# EAGLE design charginator_v1 (EAGLE 9.3.0)

## Sheet 1 of 4
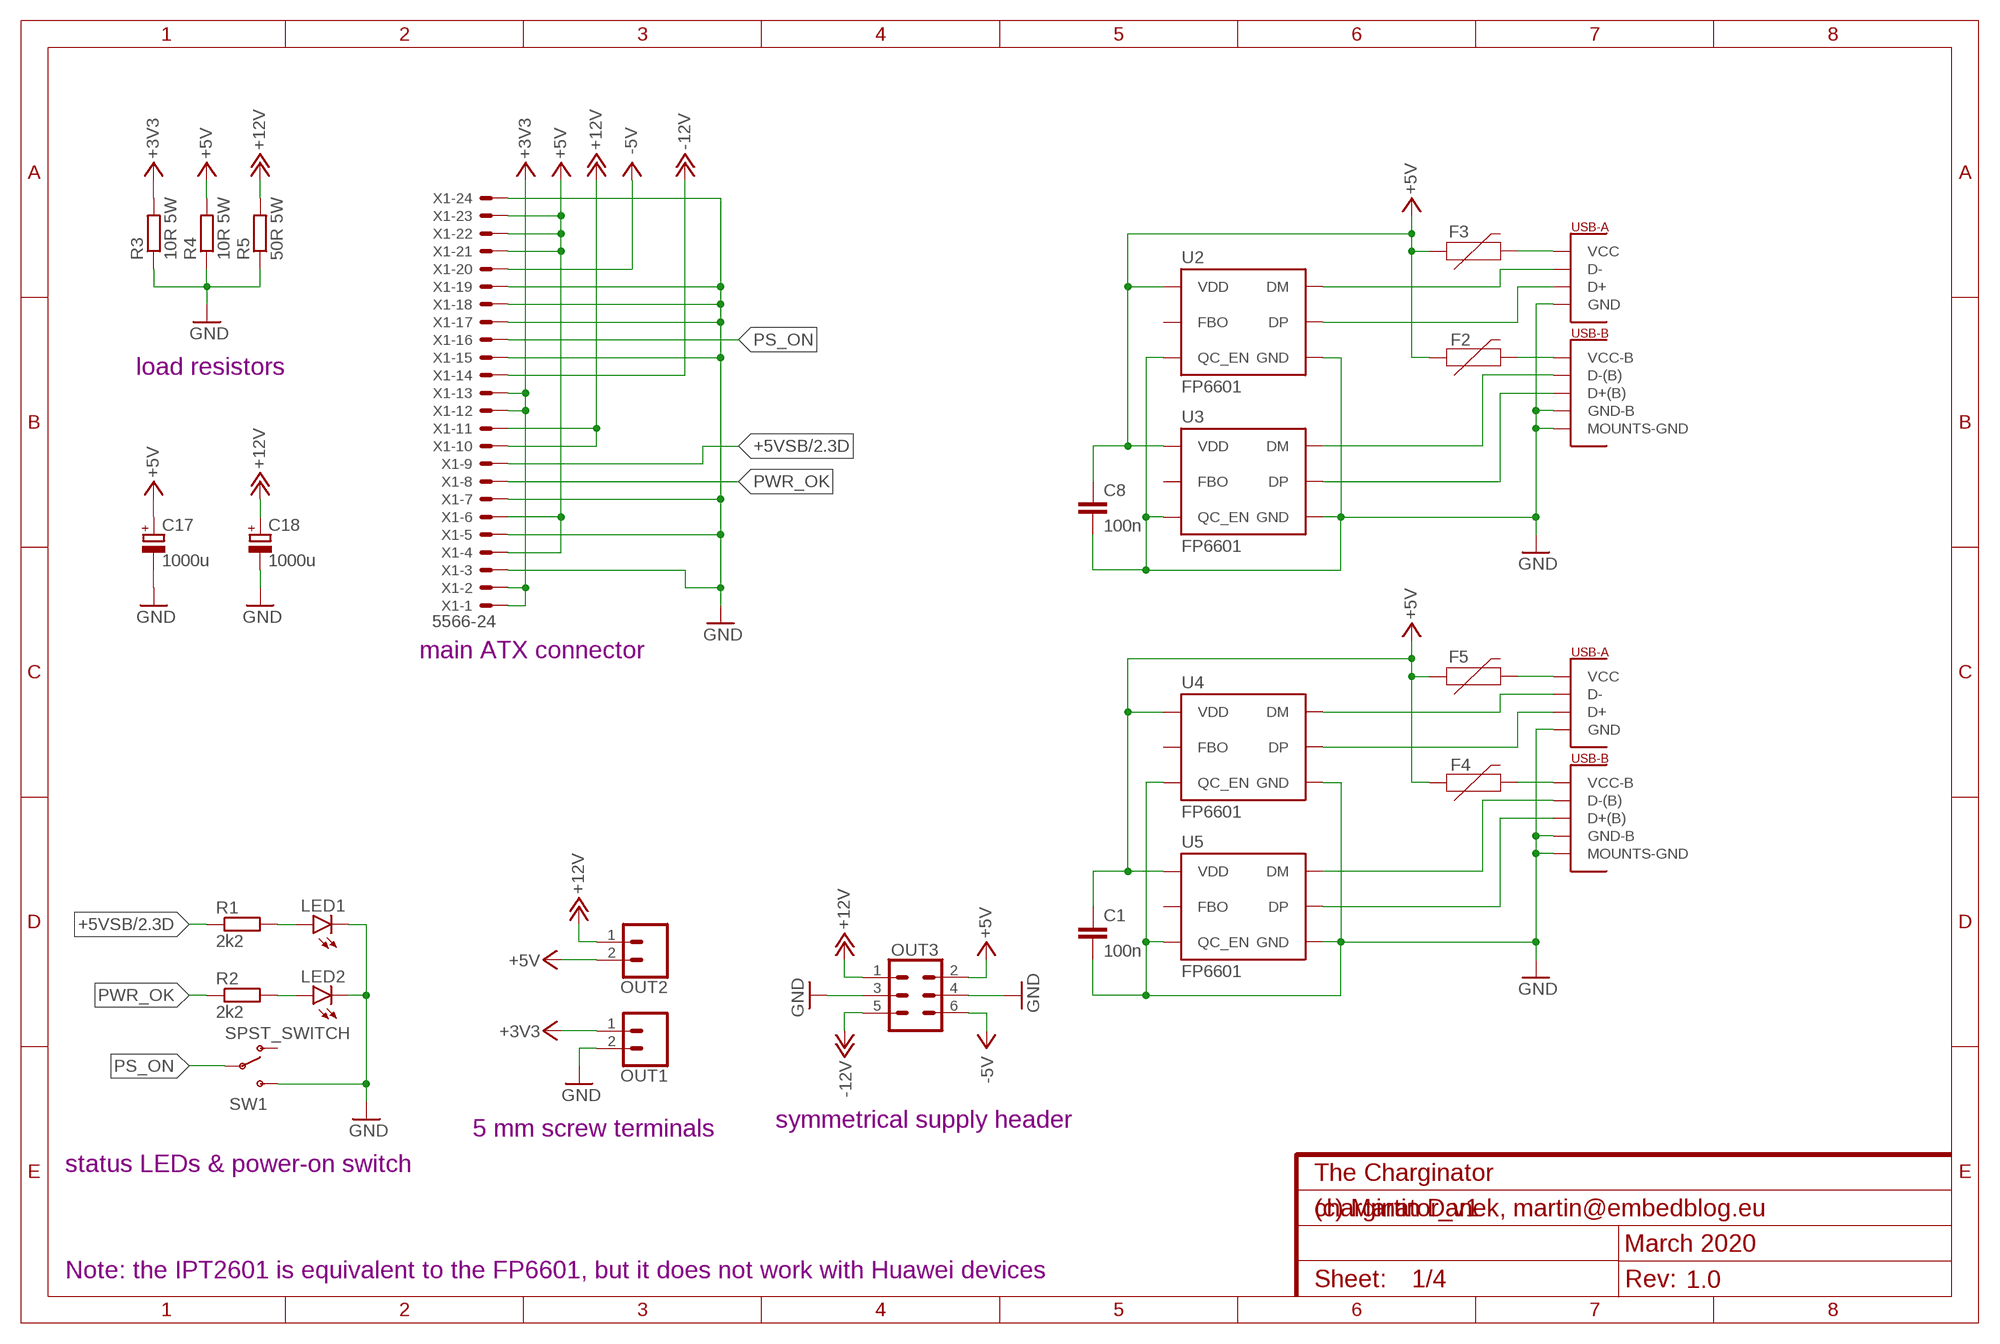
[diagram p0: schematic, sheet 1]
FRAME1 (FRAME-A4L): CNAME: The Charginator; CREVISION: 1.0

### Parts
C1  100n  C-EUC1206  [C1206]
C8  100n  C-EUC1206  [C1206]
C17  1000u  CPOL-EUE5-10.5  [E5-10,5]
C18  1000u  CPOL-EUE5-13  [E5-13]
F2  6V/2A  PPTC_HALF-AMP  [1206]
F3  6V/2A  PPTC_HALF-AMP  [1206]
F4  6V/2A  PPTC_HALF-AMP  [1206]
F5  6V/2A  PPTC_HALF-AMP  [1206]
LED1  LED5MM  [LED5MM]
LED2  LED5MM  [LED5MM]
OUT1  5MM_SCREWTERMINAL_LARGE  [SCREWTERMINAL-5MM-2]
OUT2  5MM_SCREWTERMINAL_LARGE  [SCREWTERMINAL-5MM-2]
OUT3  FEMALE 2x3  CONN_03X2FEMALE  [2X3]
R1  2k2  R-EU_M1206  [M1206]
R2  2k2  R-EU_M1206  [M1206]
R3  10R 5W  RESISTOR_5W  [POWER_RESISTOR_5W]
R4  10R 5W  RESISTOR_5W  [POWER_RESISTOR_5W]
R5  50R 5W  RESISTOR_5W  [POWER_RESISTOR_5W]
SW1  SPST_SWITCH  [TL3XYO]
U2  FP6601  IPT2601  [SOT23-6]
U3  FP6601  IPT2601  [SOT23-6]
U4  FP6601  IPT2601  [SOT23-6]
U5  FP6601  IPT2601  [SOT23-6]
U$1  DUAL-PORT-USB-REC  [DUAL-PORT-USB]
U$2  DUAL-PORT-USB-REC  [DUAL-PORT-USB]
X1  5566-24  [5566-24]

### Nets
+3V3: OUT1.1 R3.P$2 X1.1 X1.2 X1.12 X1.13
+5V: C1.1 C8.1 C17.+ F2.1 F3.1 F4.1 F5.1 OUT2.2 OUT3.2 R4.P$2 U2.5(VDD) U3.5(VDD) U4.5(VDD) U5.5(VDD) X1.4 X1.6 X1.21 X1.22 X1.23 ; also sheet 2
+5VSB: R1.1 X1.9 ; also sheet 2
+12V: C18.+ OUT2.1 OUT3.1 R5.P$2 X1.10 X1.11 ; also sheet 3,4
-5V: OUT3.6 X1.20
-12V: OUT3.5 X1.14
GND: C1.2 C8.2 C17.- C18.- LED1.K(C) LED2.K(C) OUT1.2 OUT3.3 OUT3.4 R3.P$1 R4.P$1 R5.P$1 SW1.1(S) U2.2(GND) U2.4(QC_EN) U3.2(GND) U3.4(QC_EN) U4.2(GND) U4.4(QC_EN) U5.2(GND) U5.4(QC_EN) U$1.GND(MOUNTS-GND) U$1.P$2(MOUNTS-GND) U$1.P$3(MOUNTS-GND) U$1.P$4(MOUNTS-GND) U$1.P$9(GND-B) U$1.P$11(GND) U$2.GND(MOUNTS-GND) U$2.P$2(MOUNTS-GND) U$2.P$3(MOUNTS-GND) U$2.P$4(MOUNTS-GND) U$2.P$9(GND-B) U$2.P$11(GND) X1.3 X1.5 X1.7 X1.15 X1.17 X1.18 X1.19 X1.24 ; also sheet 2,3,4
N$1: LED1.A R1.2
N$2: LED2.A R2.2
N$4: F4.2 U$2.P$10(VCC-B)
N$6: F5.2 U$2.P$12(VCC)
N$7: F2.2 U$1.P$10(VCC-B)
N$8: F3.2 U$1.P$12(VCC)
N$9: U2.6(DM) U$1.P$7(D-)
N$10: U2.1(DP) U$1.P$8(D+)
N$11: U4.6(DM) U$2.P$7(D-)
N$12: U4.1(DP) U$2.P$8(D+)
N$13: U5.6(DM) U$2.P$5(D-(B))
N$14: U5.1(DP) U$2.P$6(D+(B))
N$17: U3.6(DM) U$1.P$5(D-(B))
N$18: U3.1(DP) U$1.P$6(D+(B))
PS_ON: SW1.2(P) X1.16
PWR_OK: R2.1 X1.8
Unconnected: SW1.3(O) U2.3(FBO) U3.3(FBO) U4.3(FBO) U5.3(FBO)

### Notes on the sheet
- load resistors
- main ATX connector
- symmetrical supply header
- 5 mm screw terminals
- status LEDs & power-on switch
- (c) Martin Danek, martin@embedblog.eu
- March 2020
- Note: the IPT2601 is equivalent to the FP6601, but it does not work with Huawei devices

## Sheet 2 of 4
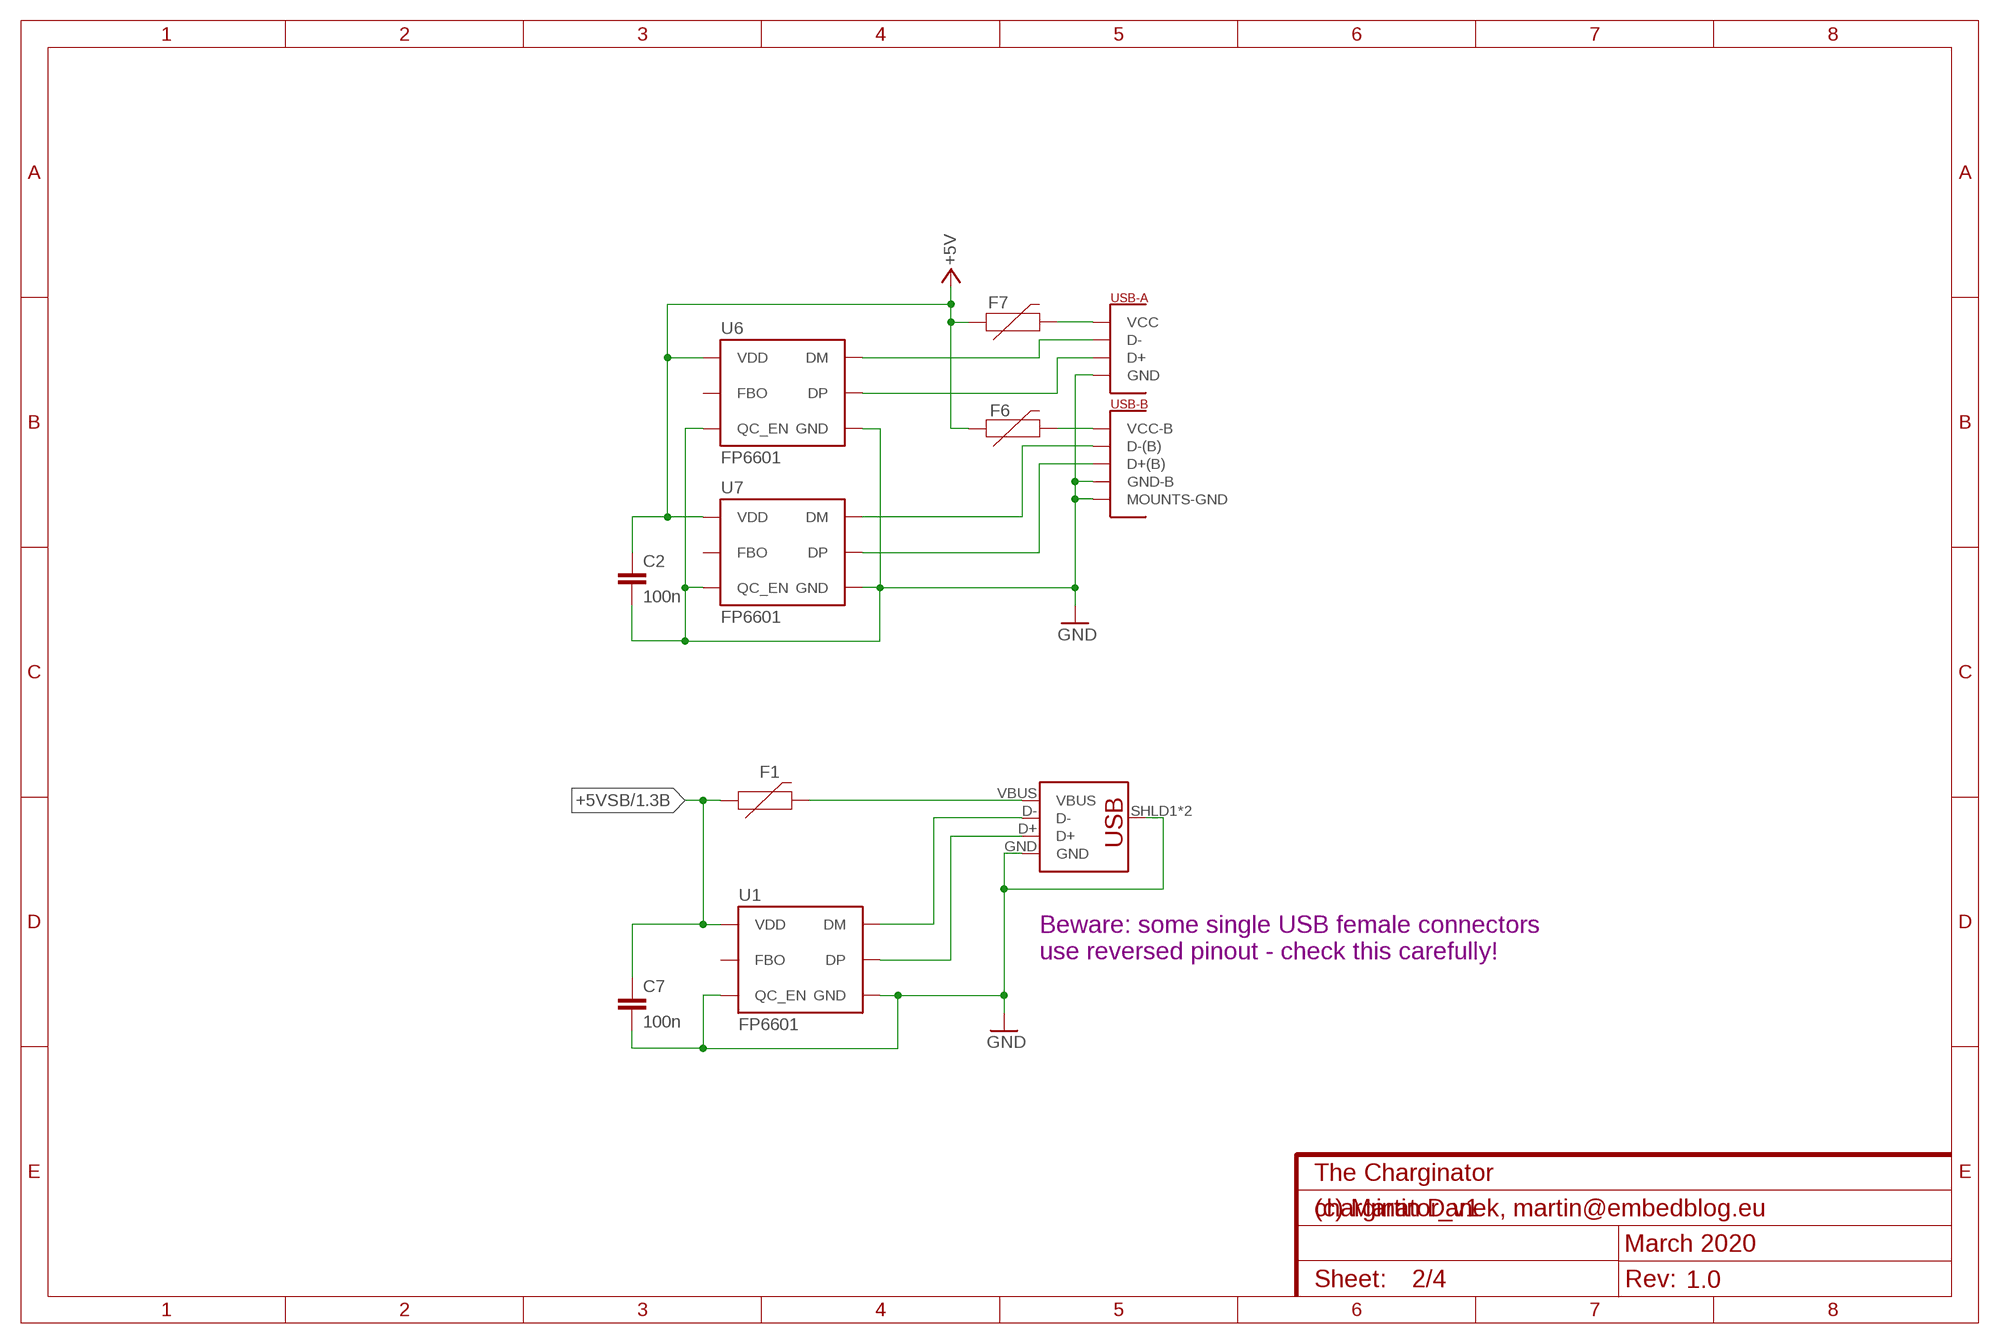
[diagram p1: schematic, sheet 2]
FRAME2 (FRAME-A4L): CNAME: The Charginator; CREVISION: 1.0

### Parts
C2  100n  C-EUC1206  [C1206]
C7  100n  C-EUC1206  [C1206]
F1  6V/2A  PPTC_HALF-AMP  [1206]
F6  6V/2A  PPTC_HALF-AMP  [1206]
F7  6V/2A  PPTC_HALF-AMP  [1206]
U1  FP6601  IPT2601  [SOT23-6]
U6  FP6601  IPT2601  [SOT23-6]
U7  FP6601  IPT2601  [SOT23-6]
U$3  DUAL-PORT-USB-REC  [DUAL-PORT-USB]
U$5  USB_A_REVERSED  [USB-A-S-SILK-FEMALE]

### Nets
+5V: C2.1 F6.1 F7.1 U6.5(VDD) U7.5(VDD) ; also sheet 1
+5VSB: C7.1 F1.1 U1.5(VDD) ; also sheet 1
GND: C2.2 C7.2 U1.2(GND) U1.4(QC_EN) U6.2(GND) U6.4(QC_EN) U7.2(GND) U7.4(QC_EN) U$3.GND(MOUNTS-GND) U$3.P$2(MOUNTS-GND) U$3.P$3(MOUNTS-GND) U$3.P$4(MOUNTS-GND) U$3.P$9(GND-B) U$3.P$11(GND) U$5.GND U$5.SHLD1(SHIELD) U$5.SHLD2(SHIELD) ; also sheet 1,3,4
N$3: F1.2 U$5.VBUS
N$5: U1.6(DM) U$5.D-
N$15: F6.2 U$3.P$10(VCC-B)
N$16: U1.1(DP) U$5.D+
N$19: F7.2 U$3.P$12(VCC)
N$20: U6.6(DM) U$3.P$7(D-)
N$21: U6.1(DP) U$3.P$8(D+)
N$22: U7.6(DM) U$3.P$5(D-(B))
N$23: U7.1(DP) U$3.P$6(D+(B))
Unconnected: U1.3(FBO) U6.3(FBO) U7.3(FBO)

### Notes on the sheet
- Beware: some single USB female connectors
  use reversed pinout - check this carefully!
- (c) Martin Danek, martin@embedblog.eu
- March 2020

## Sheet 3 of 4
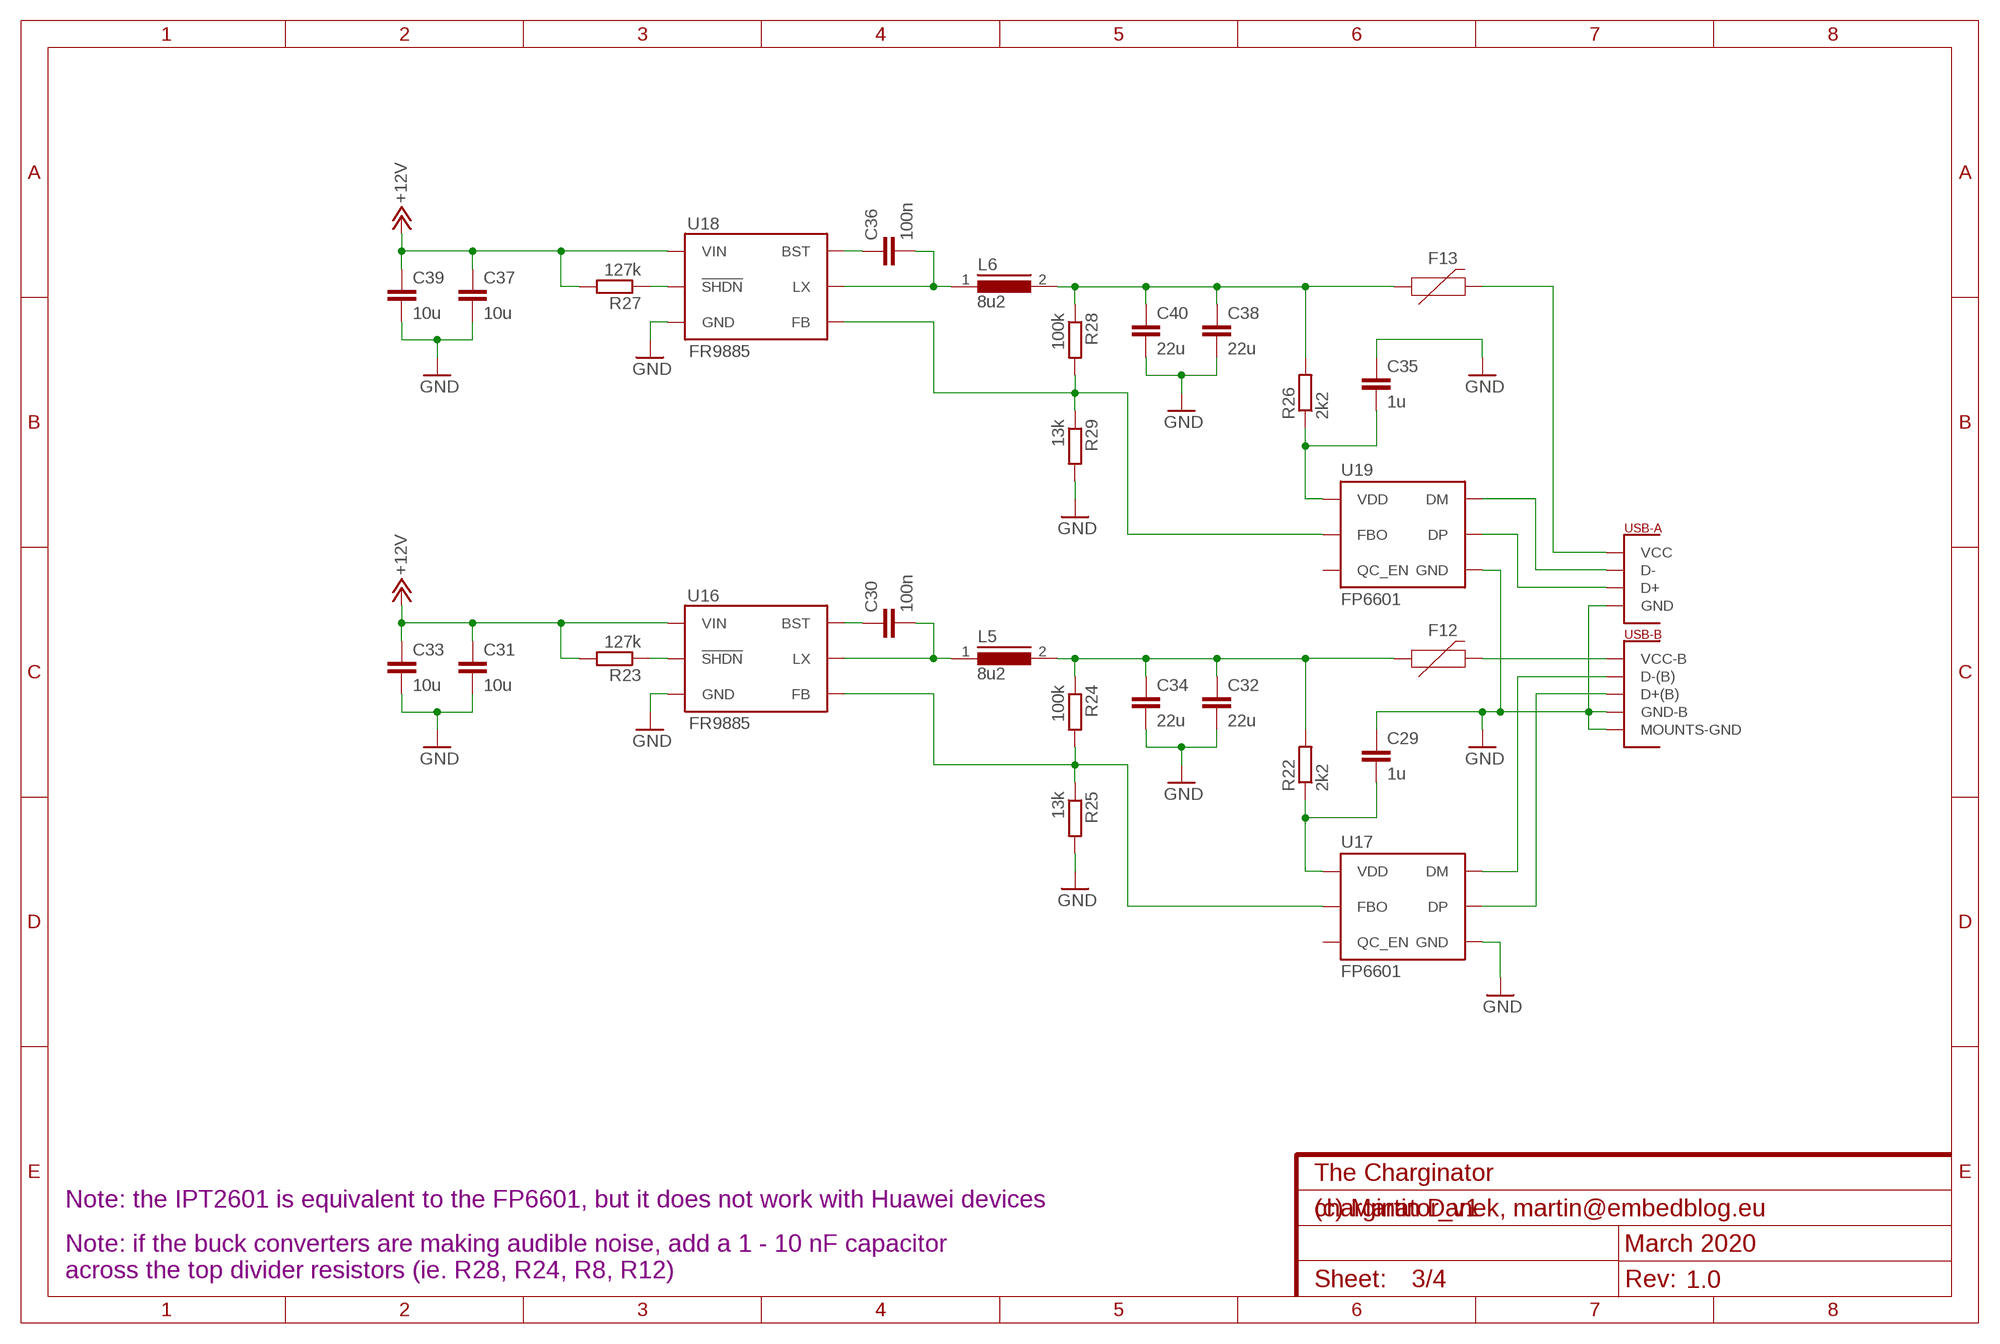
[diagram p2: schematic, sheet 3]
FRAME3 (FRAME-A4L): CNAME: The Charginator; CREVISION: 1.0

### Parts
C29  1u  C-EUC1206  [C1206]
C30  100n  C-EUC1206  [C1206]
C31  10u  C-EUC1206  [C1206]
C32  22u  C-EUC1206  [C1206]
C33  10u  C-EUC1206  [C1206]
C34  22u  C-EUC1206  [C1206]
C35  1u  C-EUC1206  [C1206]
C36  100n  C-EUC1206  [C1206]
C37  10u  C-EUC1206  [C1206]
C38  22u  C-EUC1206  [C1206]
C39  10u  C-EUC1206  [C1206]
C40  22u  C-EUC1206  [C1206]
F12  12V/2A  PPTC_HALF-AMP  [1206]
F13  12V/2A  PPTC_HALF-AMP  [1206]
L5  8u2  DR73  [DR73]
L6  8u2  DR73  [DR73]
R22  2k2  R-EU_R1206  [R1206]
R23  127k  R-EU_R1206  [R1206]
R24  100k  R-EU_R1206  [R1206]
R25  13k  R-EU_R1206  [R1206]
R26  2k2  R-EU_R1206  [R1206]
R27  127k  R-EU_R1206  [R1206]
R28  100k  R-EU_R1206  [R1206]
R29  13k  R-EU_R1206  [R1206]
U16  FR9885  [SOT23-6]
U17  FP6601  IPT2601  [SOT23-6]
U18  FR9885  [SOT23-6]
U19  FP6601  IPT2601  [SOT23-6]
U$6  DUAL-PORT-USB-REC  [DUAL-PORT-USB]

### Nets
+12V: C31.1 C33.1 C37.1 C39.1 R23.2 R27.2 U16.5(VIN) U18.5(VIN) ; also sheet 1,4
FB5: R24.2 R25.1 U16.3(FB) U17.3(FBO)
FB6: R28.2 R29.1 U18.3(FB) U19.3(FBO)
GND: C29.1 C31.2 C32.2 C33.2 C34.2 C35.1 C37.2 C38.2 C39.2 C40.2 R25.2 R29.2 U16.2(GND) U17.2(GND) U18.2(GND) U19.2(GND) U$6.GND(MOUNTS-GND) U$6.P$2(MOUNTS-GND) U$6.P$3(MOUNTS-GND) U$6.P$4(MOUNTS-GND) U$6.P$9(GND-B) U$6.P$11(GND) ; also sheet 1,2,4
LX5: C30.2 L5.1 U16.6(LX)
LX6: C36.2 L6.1 U18.6(LX)
N$54: C32.1 C34.1 F12.1 L5.2 R22.2 R24.1
N$55: C29.2 R22.1 U17.5(VDD)
N$57: R23.1 U16.4(!SHDN)
N$58: C30.1 U16.1(BST)
N$59: U17.6(DM) U$6.P$5(D-(B))
N$60: U17.1(DP) U$6.P$6(D+(B))
N$61: C38.1 C40.1 F13.1 L6.2 R26.2 R28.1
N$62: C35.2 R26.1 U19.5(VDD)
N$64: R27.1 U18.4(!SHDN)
N$65: C36.1 U18.1(BST)
N$66: U19.1(DP) U$6.P$8(D+)
N$67: U19.6(DM) U$6.P$7(D-)
N$68: F13.2 U$6.P$12(VCC)
VBUS3: F12.2 U$6.P$10(VCC-B)
Unconnected: U17.4(QC_EN) U19.4(QC_EN)

### Notes on the sheet
- Note: the IPT2601 is equivalent to the FP6601, but it does not work with Huawei devices
- (c) Martin Danek, martin@embedblog.eu
- March 2020
- Note: if the buck converters are making audible noise, add a 1 - 10 nF capacitor
  across the top divider resistors (ie. R28, R24, R8, R12)

## Sheet 4 of 4
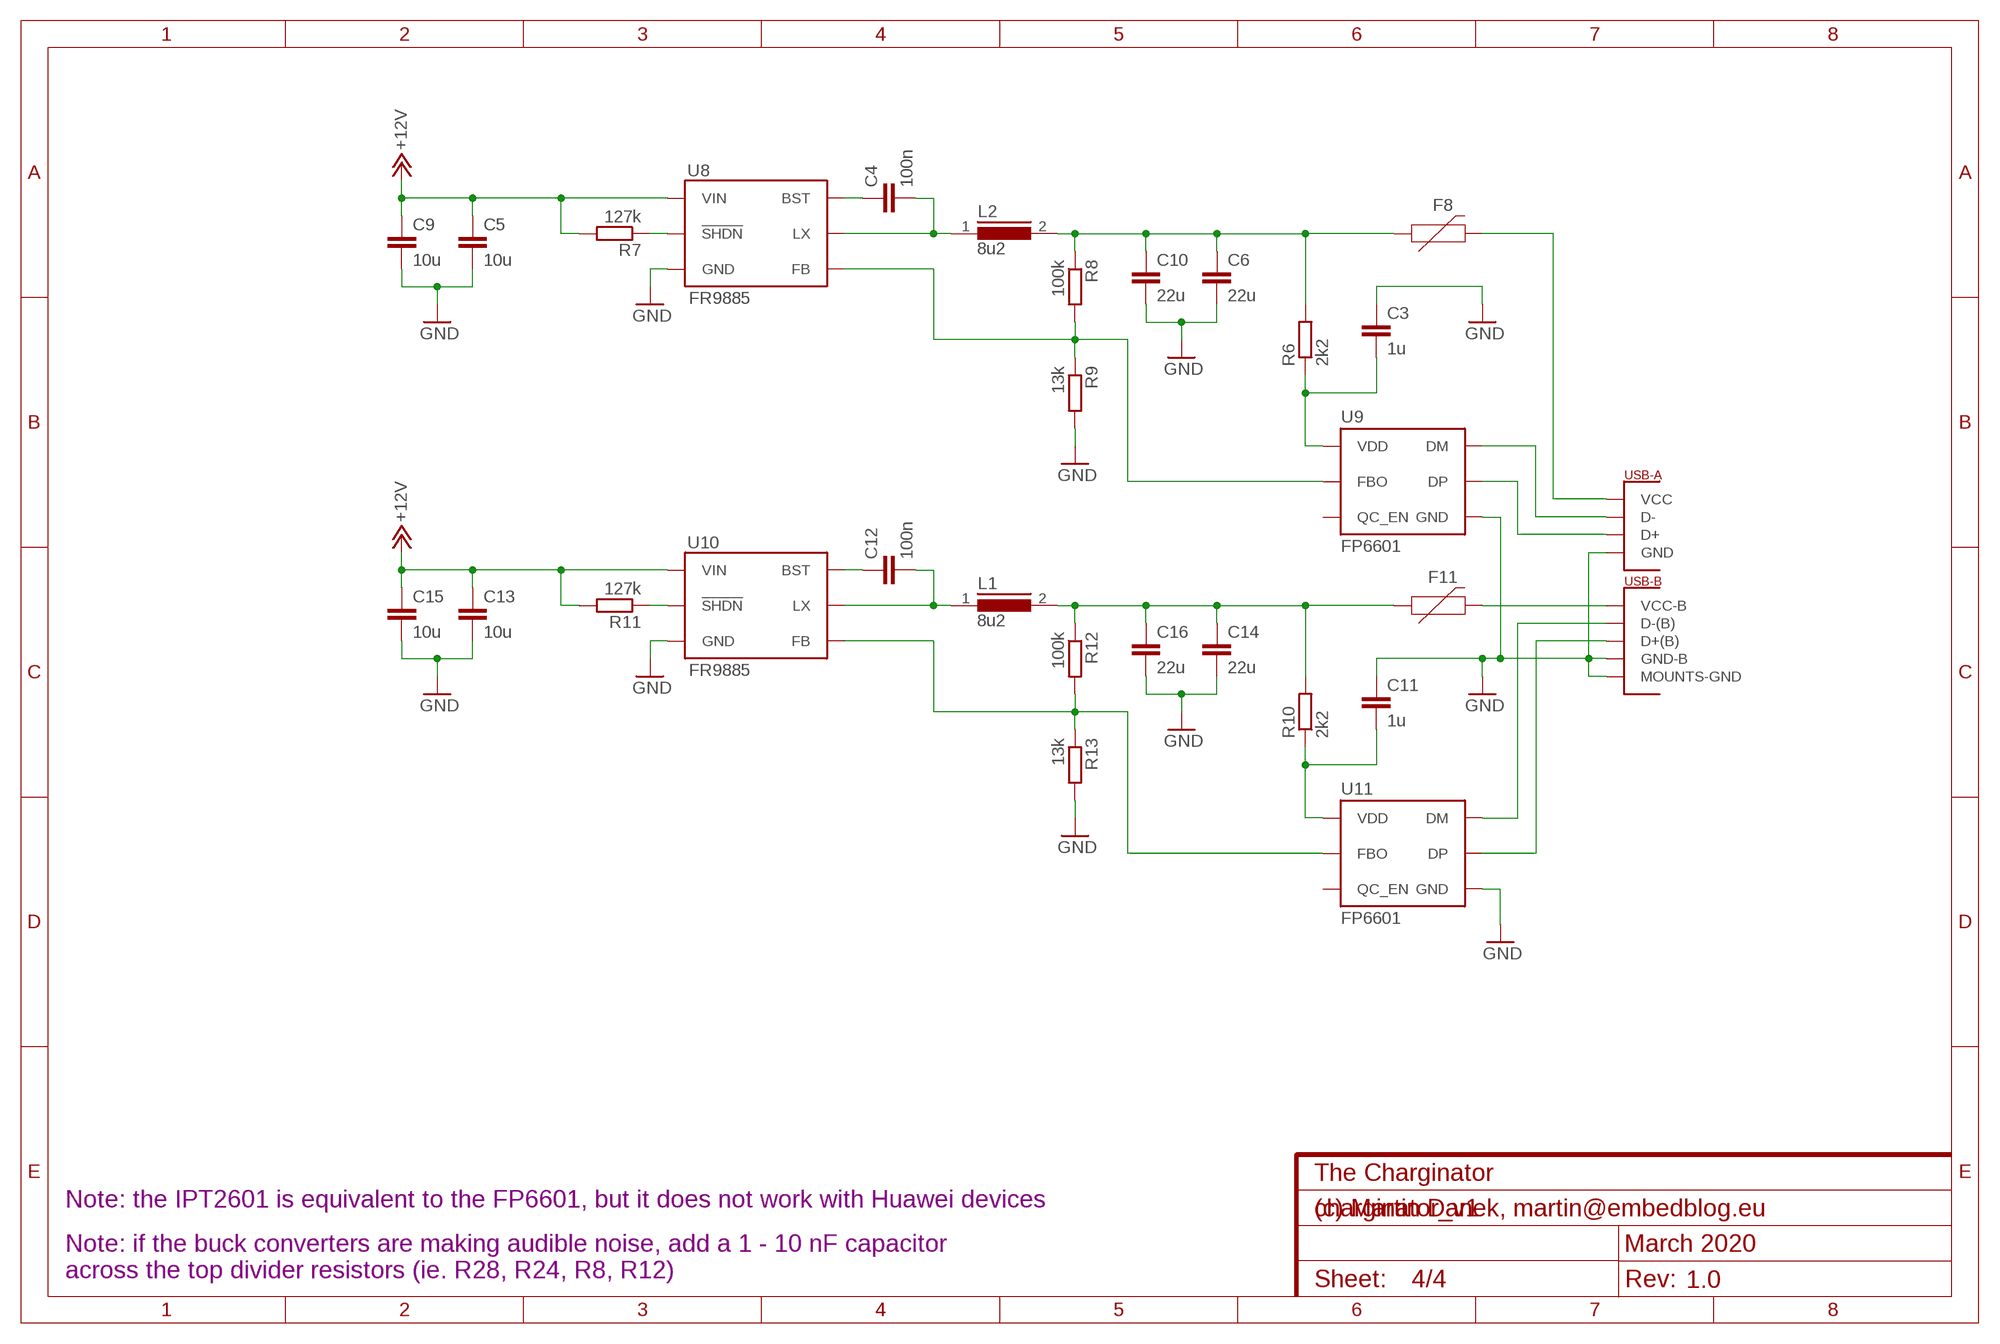
[diagram p3: schematic, sheet 4]
FRAME4 (FRAME-A4L): CNAME: The Charginator; CREVISION: 1.0

### Parts
C3  1u  C-EUC1206  [C1206]
C4  100n  C-EUC1206  [C1206]
C5  10u  C-EUC1206  [C1206]
C6  22u  C-EUC1206  [C1206]
C9  10u  C-EUC1206  [C1206]
C10  22u  C-EUC1206  [C1206]
C11  1u  C-EUC1206  [C1206]
C12  100n  C-EUC1206  [C1206]
C13  10u  C-EUC1206  [C1206]
C14  22u  C-EUC1206  [C1206]
C15  10u  C-EUC1206  [C1206]
C16  22u  C-EUC1206  [C1206]
F8  12V/2A  PPTC_HALF-AMP  [1206]
F11  12V/2A  PPTC_HALF-AMP  [1206]
L1  8u2  DR73  [DR73]
L2  8u2  DR73  [DR73]
R6  2k2  R-EU_R1206  [R1206]
R7  127k  R-EU_R1206  [R1206]
R8  100k  R-EU_R1206  [R1206]
R9  13k  R-EU_R1206  [R1206]
R10  2k2  R-EU_R1206  [R1206]
R11  127k  R-EU_R1206  [R1206]
R12  100k  R-EU_R1206  [R1206]
R13  13k  R-EU_R1206  [R1206]
U8  FR9885  [SOT23-6]
U9  FP6601  IPT2601  [SOT23-6]
U10  FR9885  [SOT23-6]
U11  FP6601  IPT2601  [SOT23-6]
U$4  DUAL-PORT-USB-REC  [DUAL-PORT-USB]

### Nets
+12V: C5.1 C9.1 C13.1 C15.1 R7.2 R11.2 U8.5(VIN) U10.5(VIN) ; also sheet 1,3
FB1: R12.2 R13.1 U10.3(FB) U11.3(FBO)
FB2: R8.2 R9.1 U8.3(FB) U9.3(FBO)
GND: C3.1 C5.2 C6.2 C9.2 C10.2 C11.1 C13.2 C14.2 C15.2 C16.2 R9.2 R13.2 U8.2(GND) U9.2(GND) U10.2(GND) U11.2(GND) U$4.GND(MOUNTS-GND) U$4.P$2(MOUNTS-GND) U$4.P$3(MOUNTS-GND) U$4.P$4(MOUNTS-GND) U$4.P$9(GND-B) U$4.P$11(GND) ; also sheet 1,2,3
LX1: C12.2 L1.1 U10.6(LX)
LX2: C4.2 L2.1 U8.6(LX)
N$24: C6.1 C10.1 F8.1 L2.2 R6.2 R8.1
N$25: C3.2 R6.1 U9.5(VDD)
N$27: R7.1 U8.4(!SHDN)
N$28: C4.1 U8.1(BST)
N$29: U9.1(DP) U$4.P$8(D+)
N$30: U9.6(DM) U$4.P$7(D-)
N$31: F8.2 U$4.P$12(VCC)
N$33: C14.1 C16.1 F11.1 L1.2 R10.2 R12.1
N$34: C11.2 R10.1 U11.5(VDD)
N$36: R11.1 U10.4(!SHDN)
N$37: C12.1 U10.1(BST)
N$38: U11.6(DM) U$4.P$5(D-(B))
N$39: U11.1(DP) U$4.P$6(D+(B))
VBUS1: F11.2 U$4.P$10(VCC-B)
Unconnected: U9.4(QC_EN) U11.4(QC_EN)

### Notes on the sheet
- Note: the IPT2601 is equivalent to the FP6601, but it does not work with Huawei devices
- (c) Martin Danek, martin@embedblog.eu
- March 2020
- Note: if the buck converters are making audible noise, add a 1 - 10 nF capacitor
  across the top divider resistors (ie. R28, R24, R8, R12)

## Library data of the parts
C1-C16 C29-C40 = resistor:C-EU: CAPACITOR, European symbol
C17 C18 = resistor:CPOL-EU: POLARIZED CAPACITOR, European symbol
F1-F8 F11-F13 = SparkFun-Fuses:PPTC: Resettable Fuse PPTC Resettable Fuse. Really a sort of resistor with a polymeric positive temperature coefficient whose resistance increases dramatically with an increase in temperature. When heated by the power passing through the resistance rises causing the current to be limited, protecting the circuit. This is achieved by the transition of the polymer from a crystalline to an amorphous state where the conductive carbon separates breaking the conductive pathways found in the cool crystalline structure. When a PPTC cools back down it resumes conducting letting the circuit turn back on. SparkFun Products: SparkFun RedBoard - Programmed with Arduino <https://www.sparkfun.com/products/12757> Pro Micro - 5V/16MHz <https://www.sparkfun.com/products/12640> Arduino Pro 328 - 5V/16MHz <https://www.sparkfun.com/products/10915> MP3 Trigger <https://www.sparkfun.com/products/13720>; PROD_ID: RES-08585; VALUE: 6V/0.5A
L1 L2 L5 L6 = inductors:DR73: High Power Density, High Efficiency, Shielded Inductors Source: coiltronics_dr_series.pdf; SPICEPREFIX: L
LED1 LED2 = led:LED: LED OSRAM: - CHIPLED LG R971, LG N971, LY N971, LG Q971, LY Q971, LO R971, LY R971 LH N974, LH R974 LS Q976, LO Q976, LY Q976 LO Q996 - Hyper CHIPLED LW Q18S LB Q993, LB Q99A, LB R99A - SideLED LS A670, LO A670, LY A670, LG A670, LP A670 LB A673, LV A673, LT A673, LW A673 LH A674 LY A675 LS A676, LA A676, LO A676, LY A676, LW A676 LS A679, LY A679, LG A679 - Hyper Micro SIDELED® LS Y876, LA Y876, LO Y876, LY Y876 LT Y87S - SmartLED LW L88C, LW L88S LB L89C, LB L89S, LG L890 LS L89K, LO L89K, LY L89K LS L896, LA L896, LO L896, LY L896 - TOPLED LS T670, LO T670, LY T670, LG T670, LP T670 LSG T670, LSP T670, LSY T670, LOP T670, LYG T670 LG T671, LOG T671, LSG T671 LB T673, LV T673, LT T673, LW T673 LH T674 LS T676, LA T676, LO T676, LY T676, LB T676, LH T676, LSB T676, LW T676 LB T67C, LV T67C, LT T67C, LS T67K, LO T67K, LY T67K, LW E67C LS E67B, LA E67B, LO E67B, LY E67B, LB E67C, LV E67C, LT E67C LW T67C LS T679, LY T679, LG T679 LS T770, LO T770, LY T770, LG T770, LP T770 LB T773, LV T773, LT T773, LW T773 LH T774 LS E675, LA E675, LY E675, LS T675 LS T776, LA T776, LO T776, LY T776, LB T776 LHGB T686 LT T68C, LB T68C - Hyper Mini TOPLED® LB M676 - Mini TOPLED Santana® LG M470 LS M47K, LO M47K, LY M47K Source: http://www.osram.convergy.de LUXEON: - LUMILED® LXK2-PW12-R00, LXK2-PW12-S00, LXK2-PW14-U00, LXK2-PW14-V00 LXK2-PM12-R00, LXK2-PM12-S00, LXK2-PM14-U00 LXK2-PE12-Q00, LXK2-PE12-R00, LXK2-PE12-S00, LXK2-PE14-T00, LXK2-PE14-U00 LXK2-PB12-K00, LXK2-PB12-L00, LXK2-PB12-M00, LXK2-PB14-N00, LXK2-PB14-P00, LXK2-PB14-Q00 LXK2-PR12-L00, LXK2-PR12-M00, LXK2-PR14-Q00, LXK2-PR14-R00 LXK2-PD12-Q00, LXK2-PD12-R00, LXK2-PD12-S00 LXK2-PH12-R00, LXK2-PH12-S00 LXK2-PL12-P00, LXK2-PL12-Q00, LXK2-PL12-R00 Source: www.luxeon.com KINGBRIGHT: KA-3528ASYC Source: www.kingbright.com
OUT1 OUT2 = custom:5MM_SCREWTERMINAL_LARGE
OUT3 = SparkFun-Connectors:CONN_03X2: Multi connection point. Often used as Generic Header-pin footprint for 0.1 inch spaced/style header connections You can populate with any combo of single row headers, but if you'd like an exact match, check these: Header - 2x3 (Male, 0.1") <https://www.sparkfun.com/products/12807> (PRT-12807) Header - 2x3 (Female, 0.1") <https://www.sparkfun.com/products/13010> (PRT-13010) 2x3 Pin Shrouded Header <https://www.sparkfun.com/products/10877> (PRT-10877) On any of the 0.1 inch spaced packages, you can populate with these: Break Away Headers - Straight <https://www.sparkfun.com/products/116> (PRT-00116) Break Away Male Headers - Right Angle <https://www.sparkfun.com/products/553> (PRT-00553) Female Headers <https://www.sparkfun.com/products/115> (PRT-00115) Break Away Headers - Machine Pin <https://www.sparkfun.com/products/117> (PRT-00117) Break Away Female Headers - Swiss Machine Pin <https://www.sparkfun.com/products/743> (PRT-00743) Special note: the shrouded connector mates well with our 3x2 ribbon cables: Ribbon Crimp Connector - 6-pin (2x3, Female) <https://www.sparkfun.com/products/10651> (PRT-10651) Ribbon Cable - 6 wire (15ft) <https://www.sparkfun.com/products/10646> (PRT-10646); PROD_ID: CONN-11566
R1 R2 R6-R13 R22-R29 = resistor:R-EU_: RESISTOR, European symbol
R3-R5 = custom:RESISTOR_5W
SW1 = custom:SPST_SWITCH
U1-U7 U9 U11 U17 U19 = custom:IPT2601
U8 U10 U16 U18 = custom:FR9885
U$1-U$4 U$6 = tps2511:DUAL-PORT-USB-REC: Dual USB Receptacle, Horizontal.
U$5 = custom:USB_A_REVERSED
X1 = con-molex:5566-24: Mini FIT connector 24 pol Source: http://www.molex.com; MF: MOLEX; OC_FARNELL: unknown; OC_NEWARK: unknown

## Board
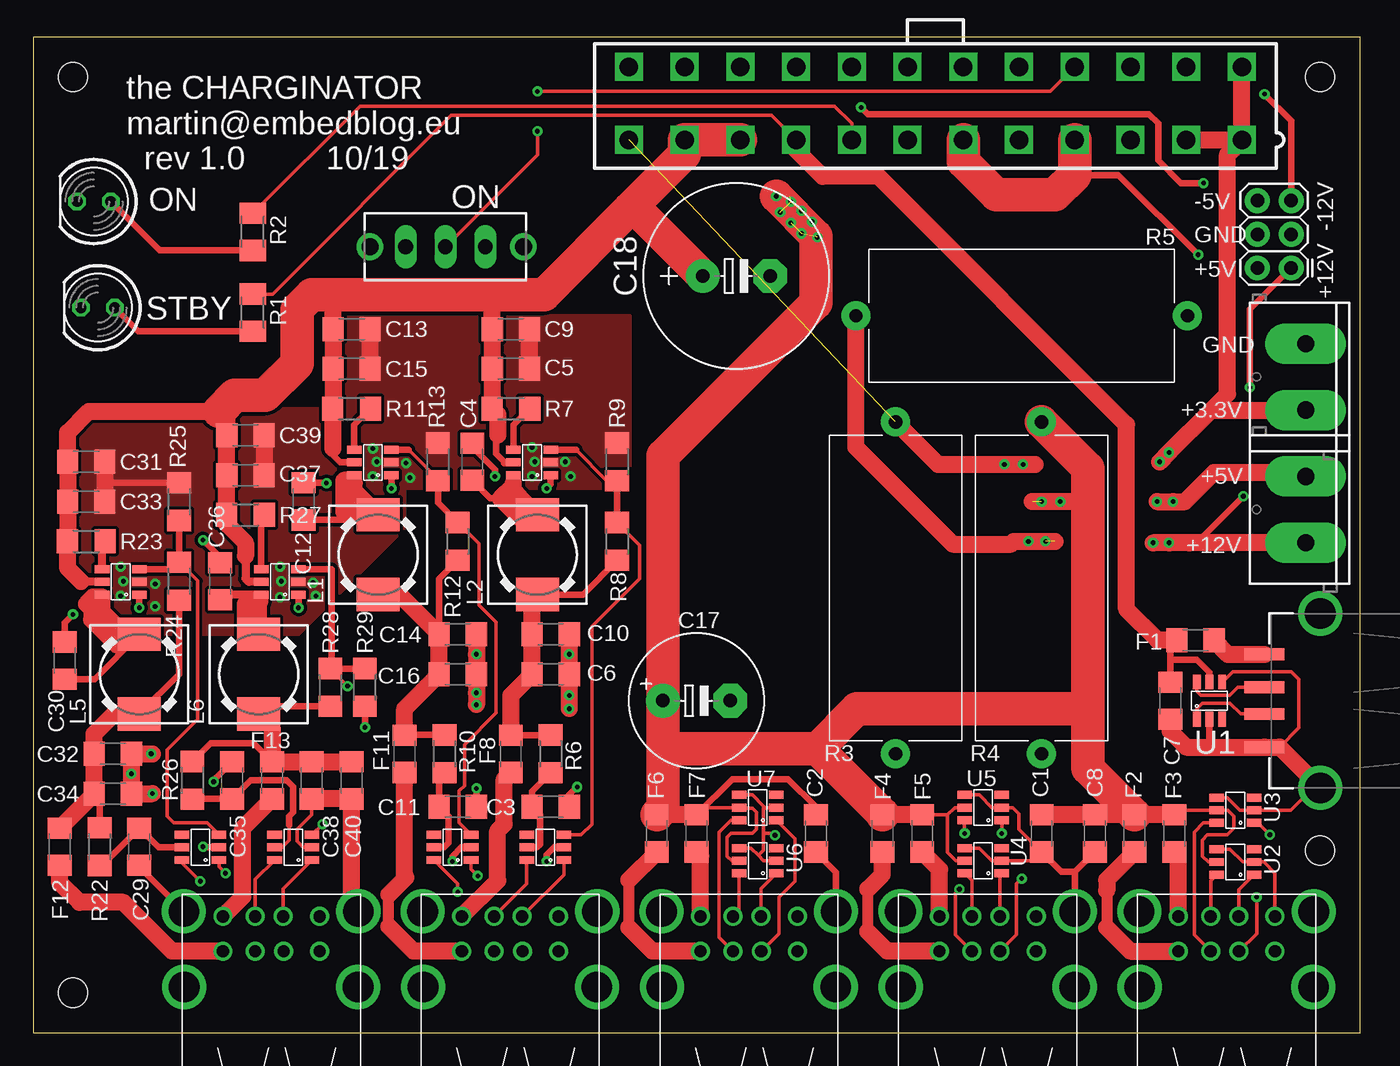
[diagram p4: board, top side]
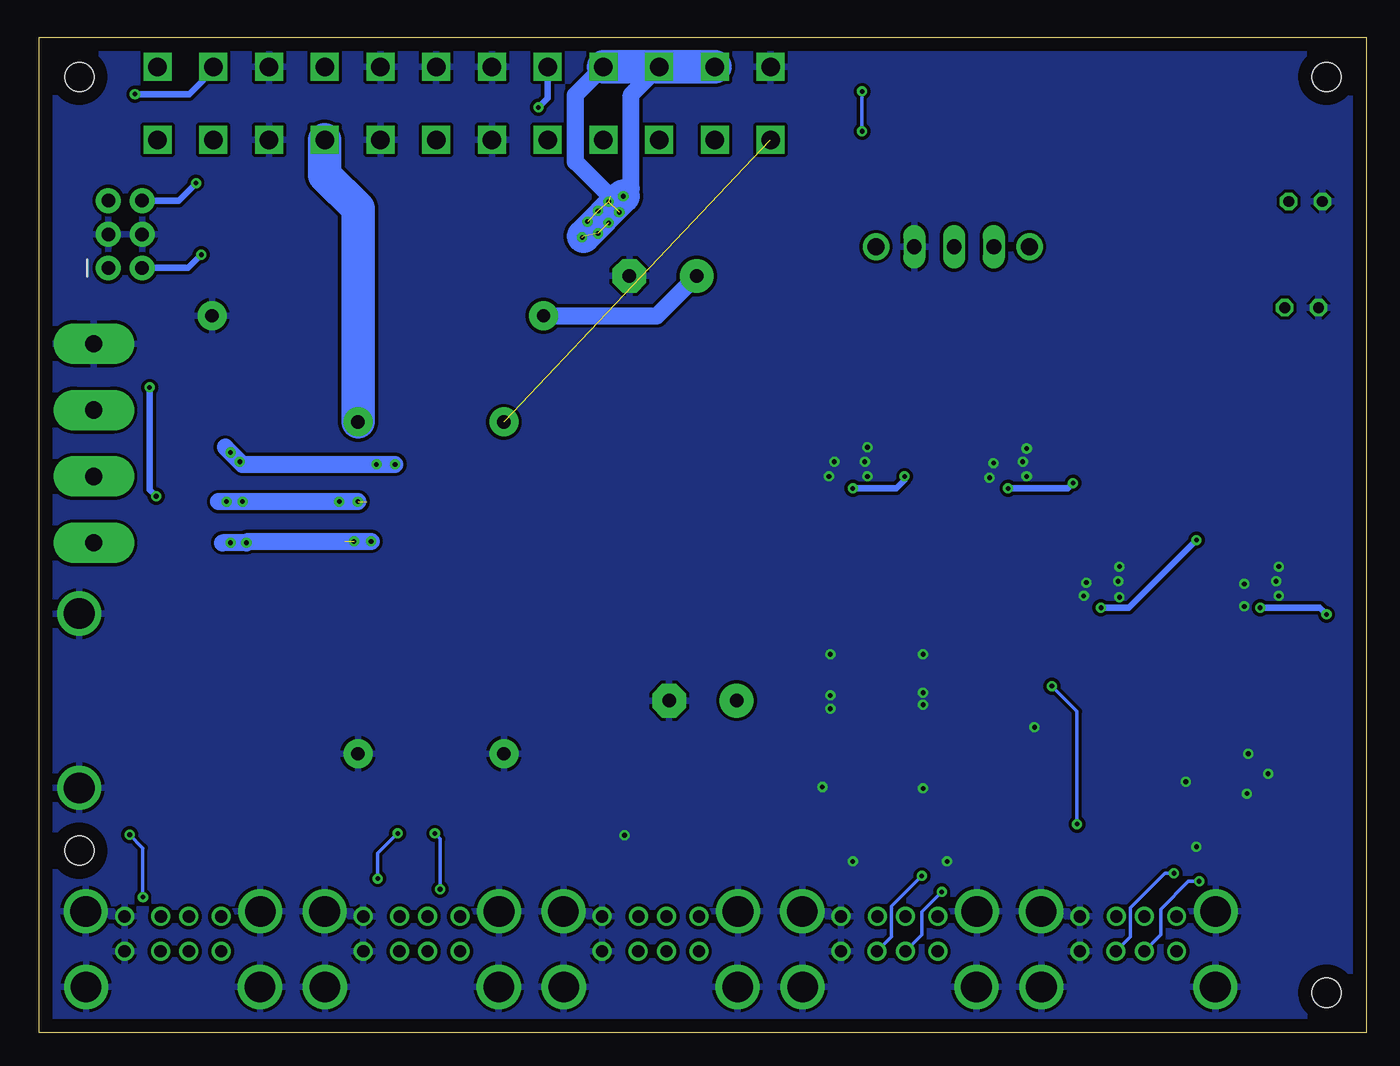
[diagram p5: board, bottom side, seen from below]

Size 100 x 75 mm. Coordinates in mm from the lower left corner, seen from the top.
Outline: 0,0 100,0 100,75 0,75 0,0
Copper layers (1*16): Top 0.035mm / dielectric 1.5mm / Bottom 0.035mm
Design rules "default": minimum track width 6mil, minimum drill 0.35mm, track to track 6mil, track to pad 6mil, pad to pad 6mil, via to via 6mil, smd to smd 6mil, copper to edge 40mil, drill to drill 6mil, minimum pad ring 10mil, minimum via ring 8mil, stop-mask expansion 4mil, vias tented up to drill 0mil, thermal gap 10mil
Holes 2.2 mm at 3,72 97,72 3,3 97,13.7

### Footprints (pad centres in the part's own frame; a part is rotated, then mirrored left to right if it is on the bottom)
C1206 = smd 1.6 x 1.8: 1 -1.4,0; 2 1.4,0
E5-10,5 = drill 1.016 pad 2.54: + -2.54,0 | drill 1.016 pad 2.54 octagon: - 2.54,0
E5-13 = drill 1.016 pad 2.54: + -2.54,0 | drill 1.016 pad 2.54 octagon: - 2.54,0
1206 = smd 1.6 x 1.8: 1 -1.4,0; 2 1.4,0
DR73 = smd 2.5 x 3.25: 1 -3,0; 2 3,0
LED5MM = drill 0.813 octagon: A -1.27,0; K 1.27,0
SCREWTERMINAL-5MM-2 = drill 1.3 pad 3.048 long: 1 0,0; 2 5,0
2X3 = drill 1.016 pad 1.88: 1 0,0; 2 0,2.54; 3 2.54,0; 4 2.54,2.54; 5 5.08,0; 6 5.08,2.54
M1206 = smd 1.6 x 2: 1 -1.4,0; 2 1.4,0
POWER_RESISTOR_5W = drill 1 pad 2.184: P$1 0,0; P$2 25,0
R1206 = smd 1.6 x 1.803: 1 -1.422,0; 2 1.422,0
TL3XYO = drill 1.1 pad 1.422 long: 1 -3,0; 2 0,0; 3 3,0 | drill 1.3 pad 2: M1 -5.88,0; M2 5.68,0
SOT23-6 = smd 0.6 x 1.1: 1 0,0; 2 0.95,0; 3 1.9,0; 4 1.9,2.8; 5 0.95,2.8; 6 0,2.8
DUAL-PORT-USB = drill 2.311: GND -7.645,0.127; P$2 -7.62,-5.563; P$3 5.512,0.127; P$4 5.486,-5.563 | drill 0.92: P$5 -2.261,-2.87; P$6 -0.127,-2.87; P$7 -2.261,-0.254; P$8 -0.152,-0.254; P$9 2.591,-2.87; P$10 -4.699,-2.87; P$11 2.591,-0.254; P$12 -4.699,-0.254
USB-A-S-SILK-FEMALE = smd 3 x 0.9: D+ 7.212,1; D- 7.212,-1; GND 7.212,3.5; VBUS 7.212,-3.5 | drill 2.311: SHLD1 3,-6.566; SHLD2 3,6.566
5566-24 = drill 1.4 square: 1 23.1,-2.75; 2 18.9,-2.75; 3 14.7,-2.75; 4 10.5,-2.75; 5 6.3,-2.75; 6 2.1,-2.75; 7 -2.1,-2.75; 8 -6.3,-2.75; 9 -10.5,-2.75; 10 -14.7,-2.75; 11 -18.9,-2.75; 12 -23.1,-2.75; 13 23.1,2.75; 14 18.9,2.75; 15 14.7,2.75; 16 10.5,2.75; 17 6.3,2.75; 18 2.1,2.75; 19 -2.1,2.75; 20 -6.3,2.75; 21 -10.5,2.75; 22 -14.7,2.75; 23 -18.9,2.75; 24 -23.1,2.75

### Placement (x,y rotation side)
C1  76,15 270 top
C2  59,15 270 top
C3  39,17 180 top
C4  33.1,43 270 top
C5  36,50 0 top
C6  39,27 0 top
C7  85.7,25 270 top
C8  80,15 270 top
C9  36,53 0 top
C10  39,30 0 top
C11  32,17 180 top
C12  20.37,40.02 270 top
C13  24,53 0 top
C14  32,30 0 top
C15  24,50 0 top
C16  32,27 0 top
C17  50,25 0 top
C18  53,57 0 top
C29  8,14 90 top
C30  2.37,28.02 270 top
C31  4,43 0 top
C32  6,21 0 top
C33  4,40 0 top
C34  6,18 0 top
C35  15,19 270 top
C36  14.1,34 270 top
C37  16,42 0 top
C38  21,19 270 top
C39  16,45 0 top
C40  24,19 270 top
F1  87.6,29.55 0 top
F2  83,15 270 top
F3  86,15 270 top
F4  64,15 270 top
F5  67,15 270 top
F6  47,15 270 top
F7  50,15 270 top
F8  36,21 270 top
F11  28,21 270 top
F12  2,14 270 top
F13  18,19 270 top
L1  26,36 270 top
L2  38,36 270 top
L5  8,27 270 top
L6  17,27 270 top
LED1  4.88,54.61 180 top
LED2  4.58,62.61 180 top
OUT1  95.9,46.9 90 top
OUT2  95.9,36.9 90 top
OUT3  94.8,57.6 90 top
R1  16.55,54.24 270 top
R2  16.55,60.32 270 top
R3  65,21 90 top
R4  76,21 90 top
R5  87,54 180 top
R6  39,21 90 top
R7  36,47 180 top
R8  44,37 90 top
R9  44,43 90 top
R10  31,21 90 top
R11  24,47 180 top
R12  32,37 90 top
R13  30.5,43 90 top
R22  5,14 90 top
R23  4,37 180 top
R24  11,34 90 top
R25  11,40 90 top
R26  12,19 90 top
R27  16,39 180 top
R28  22.4,26 90 top
R29  25,26 270 top
SW1  31.07,59.2 180 top
U1  87.7,23.6 0 top
U2  92,11.9 90 top
U3  92,15.8 90 top
U4  73,12 90 top
U5  73,16 90 top
U6  56,12 90 top
U7  56,16 90 top
U8  39,42 90 top
U9  40,13 90 top
U10  27,42 90 top
U11  33,13 90 top
U16  8,33 90 top
U17  14,13 90 top
U18  20,33 90 top
U19  21,13 90 top
U$1  91,9 0 top
U$2  73,9 0 top
U$3  55,9 0 top
U$4  37,9 0 top
U$5  100,25 180 top
U$6  19,9 0 top
X1  68,70 0 top

### Tracks (layer width: path | path; a pad name or v marks a point on that pad's centre or on a via)
+3V3  (via drill 0.35)  (1 unrouted)
  Top 1.27: X1.2 X1.1 | X1.1 X1.13 | R3.P$2 68.2,42.8 v73.2,42.8 75.5,42.8 | v84.9,43 v85.6,43.7 88.8,46.9 | 88.8,46.9 90,48.1 90,66.15 X1.1 | 88.8,46.9 OUT1.1
  Bottom 1.27: v73.2,42.8 v74.6,42.8 84.7,42.8 v84.9,43 86,44.1
+5V  (via drill 0.35)  (8 unrouted)
  Top 0.254: U2.5 88.55,12.85 88.1,13.3 88.1,14.5 88.5,14.9 90,14.9 90.5,15.4 90.5,16.3 90.05,16.75 U3.5 86.35,16.75 F3.1 | U4.5 69.55,12.95 68.9,13.6 68.9,16.4 | U5.5 69.45,16.95 68.9,16.4 | F5.1 68.9,16.4 | U6.5 52.65,12.95 52.3,13.3 52.3,14.7 52.6,15 54.2,15 54.5,15.3 54.5,16.6 54.2,16.9 53.25,16.9 U7.5 50.55,16.95 F7.1
  Top 0.508: F7.1 52.7,19.1 56.9,19.1 59,17 C2.1 | v87.8,58.6 81.8,64.6 78.5,64.6
  Top 1.27: F3.1 F2.1 C8.1 C1.1 | F5.1 F4.1 | F7.1 F6.1 | v84.7,40 v85.9,40 86.8,40 89,42.2 95.6,42.2 OUT2.2 | 79.5,40 75.3,40
  Top 2.54: 47.46,21 C17.+ 47.46,43.46 59,55 59,60 v56,63 | 47.46,21 47.46,16.86 F6.1 | F2.1 79.5,19.9 79.5,24.6 | X1.4 78.5,64.6 77,63.1 72.6,63.1 70.1,65.6 X1.6 | R4.P$2 79.5,42.5 79.5,40 79.5,24.6 | 47.46,21 47.86,21.4 59.1,21.4 | 59.1,21.4 64,16.5 F4.1 | 59.1,21.4 62.1,24.4 79.3,24.4 79.5,24.6
  Bottom 0.508: OUT3.2 88.8,57.6 v87.8,58.6
  Bottom 1.27: X1.22 55.4,70.65 55.4,63.6 v56,63 57,63 59.6,65.6 59.6,70.65 X1.21 | v76,40 v77.4,40 v84.7,40 86.5,40
  Bottom 2.54: X1.23 X1.22 X1.21 | v56,63 59,60 | R4.P$2 76,62.1 78.5,64.6 X1.4
  other vias: 56.3,61.8 57.1,62.6 57.9,61.9 57.1,61 58.7,61.1 57.9,60.2 59.1,59.9
+5VSB
  Top 0.254: R1.1 18.04,55.64 31.5,69.1 55.65,69.1 57.48,67.28 X1.9
  Top 0.508: 86.25,29.55 F1.1 85.7,29.05 85.7,28 | 85.7,28 C7.1 | U1.5 88.65,27.15 87.7,28.1 85.8,28.1 85.7,28
  Top 1.27: 57.48,67.28 57.48,66.53 59.5,64.5 63.7,64.5 82.4,45.8 82.4,31.9 84.75,29.55 F1.1
+12V  (via drill 0.35)  (1 unrouted)
  Top 0.508: U10.5 23.15,42.95 22.6,43.5 22.6,44 22.6,47.02 | 34.6,46.98 R7.2 | 35,45 34.9,44.9 34.9,43.6 35.5,43 35.5,42.9 36.15,42.9 U8.5 | 16,35.9 16,35.4 | OUT3.1 91.7,54.5 v91.7,48.6 | v91.2,40.4 87.7,36.9 87.1,36.9
  Top 0.61: U16.5 3.65,33.95 3.6,34 | U18.5 16.25,33.95 16,34.2 16,35.4
  Top 1.27: 22.6,44 22.58,44.02 R11.2 22.6,47.02 C15.1 C13.1 22.6,55.2 23,55.6 | 35,45 35,46.58 R7.2 34.6,47.02 C5.1 C9.1 34.6,55.2 35,55.6 | 3.6,34 2.58,35.02 R23.2 2.6,37.02 C33.1 C31.1 2.6,45.2 4.2,46.8 14,46.8 14.6,46.2 C39.1 C37.1 14.6,39.02 R27.2 14.58,38.32 16,36.9 16,35.9 | OUT2.1 87.1,36.9 v85.6,36.9 v84.4,36.9 | R5.P$2 62,44.1 69.3,36.8 73.7,36.8 73.9,37 77,37
  Top 2.54: 14,46.8 15.2,48 17.5,48 19.9,50.4 19.9,54.5 21,55.6 23,55.6 35,55.6 38.5,55.6 44.95,62.05 | 44.95,62.05 49.1,66.2 X1.11 X1.10 | C18.+ 45.41,62.05 44.95,62.05
  Bottom 0.508: v91.7,48.6 91.7,40.9 v91.2,40.4
  Bottom 1.27: R5.P$2 53.46,54 C18.+ | v75,37 v76.3,37 84.3,37 v84.4,36.9 86.2,36.9
-5V  (via drill 0.35)
  Top 0.508: v88.2,64 86.5,64 84.8,65.7 84.8,68.5 84.1,69.2 62.9,69.2 v62.4,69.7
  Bottom 0.508: OUT3.6 89.52,62.68 v88.2,64 | v62.4,69.7 61.7,70.4 X1.20
-12V  (via drill 0.35)
  Top 0.508: v92.8,70.7 94.8,68.7 OUT3.5
  Bottom 0.508: X1.14 86.9,72.5 88.7,70.7 v92.8,70.7
FB1
  Top 0.254: R13.1 30.5,41.7 28.3,43.9 | U11.3 32.1,15.8 32.1,18.2 32.5,18.6 32.5,21.7 34.9,24.1 34.9,30.9 33.6,32.2 33.6,36.82 R12.2
  Top 0.508: R13.1 30.5,39.92 R12.2 | U10.3 28.3,43.9
FB2
  Top 0.254: 40.9,43.9 43.22,41.58 R9.1 | U9.3 41.3,14.9 42.1,15.7 42.1,30.6 45.7,34.2 45.7,36.72 R8.2
  Top 0.508: R8.2 R9.1 | U8.3 40.9,43.9
FB5
  Top 0.254: U17.3 13.1,15.8 10.6,15.8 10.1,16.3 10.1,21.3 12.4,23.6 12.4,34.02 R24.2
  Top 0.508: U16.3 10.48,34.9 R24.2 R25.1
FB6  (via drill 0.35)
  Top 0.254: U19.3 v21.8,15.7 | v23.7,26.1 22.4,27.4 R28.2
  Top 0.508: R29.1 R28.2 22.5,27.52 22.5,34.9 U18.3
  Bottom 0.254: v21.8,15.7 21.8,24.2 v23.7,26.1
GND  (via drill 0.35)
  Top 0.254: U$1.P$11 93.59,12.01 92.75,12.85 U2.2 91.15,12.85 90.2,13.8 U2.4 | U3.4 90,17.7 90.95,16.75 U3.2 94.78,16.75 96.46,18.43 U$5.SHLD2 | U4.4 71.3,13.9 72.25,12.95 U4.2 75.35,12.95 C1.2 74.3,15.3 74.3,16.5 73.85,16.95 U5.2 72.25,16.95 71.3,17.9 U5.4 | U6.2 55.05,12.95 54.65,13.35 | 54.65,13.35 54.1,13.9 U6.4 | U7.4 54.2,17.9 55.05,17.05 | 55.05,17.05 55.2,16.9 55.25,16.95 U7.2 | 55.05,17.05 55.05,15 | 55.05,15 55.05,13.75 54.65,13.35 | 55.05,15 55.77,15 v55.9,14.87 | U19.2 20.35,13.95 19.9,14.4 19.9,15.3 21,16.4 C38.2 | U1.4 90.4,27.2 94.8,27.2 95.4,26.6 95.4,22.97 93.93,21.5
  Top 0.508: U$2.P$3 78.51,12.11 | 78.51,12.11 C8.2 | C2.2 60.51,12.09 U$3.P$3 | 32.94,13.89 U11.2 32.25,13.95 31.6,13.3 v31.6,12.9 | C11.1 v33.4,18.4 | C3.1 40.4,17.9 v41,18.5 | 29.97,44.95 R13.2 | U9.2 39.25,13.95 38.7,13.4 v38.7,12.9 | C29.1 8,12.48 U$6.GND | R25.2 5.48,41.42 5.4,41.5 | U17.2 12.85,13.95 v12.8,14 | C35.1 13.6,19 v13.6,18.9 | R29.2 v25,23 | C1.2 77.49,12.11 78.51,12.11 | U1.2 88.65,21.55 88.7,21.5
  Top 1.27: C14.2 v33.4,28.5 C16.2 v33.4,25.6 v33.4,24.7 | C10.2 v40.4,28.5 C6.2 v40.4,25.4 v40.4,24.4 | C15.2 C13.2 | C5.2 C9.2 | C31.2 5.4,41.5 C33.2 | C38.2 C40.2 24,9.64 U$6.P$3 | C39.2 C37.2 | v9,18 C34.2 v7.4,19.5 C32.2 v8.9,21 9,21 | U$5.SHLD2 93.93,21.5 U$5.GND 88.7,21.5 86.9,21.5 85.7,22.7 C7.2
  other vias: 28.1,42.9 25.6,44 25.9,43 37.6,44.1 37.8,43 40.1,43 40.5,41.9 25.6,41.9 28.4,41.8 37.6,41.9 18.6,35.1 18.7,34 18.6,32.8 21.1,33.9 21.3,32.9 6.8,34 6.6,35.1 6.6,32.9 9.2,33.8 9.2,32.1
  pour Bottom (isolate 0.254): 0,0 100,0 100,75 0,75
  pour Top (isolate 0.254, no thermals): 22,54 45,54 45,41 22,41
  pour Top (isolate 0.254, no thermals): 0,47 28,47 28,38 20,30 0,30
LX1
  Top 0.508: 24.2,41.4 U10.6 | 26.75,39 L1.1 25.62,38.62 C12.2
  Top 1.27: L1.1 24.2,40.8 24.2,41.4 24,41.6 23.4,41.6 23.4,39.2 24.2,39.2 24.1,39.3 24.1,39.9
LX2
  Top 0.508: 36.2,41.4 U8.6 | C4.2 34.45,40.25 35.2,40.25 36.75,40.25
  Top 1.27: L2.1 36.75,40.25 36.2,40.8 36.2,41.4 | 36.2,41.25 35.2,40.25 36.65,38.8 37,38.8
LX5
  Top 0.508: C30.2 4.62,26.62 L5.1
  Top 0.61: 5.2,32.8 U16.6
  Top 1.27: L5.1 6.9,30 5.2,31.7 5.2,32.8 4.5,32.8 4,32.3 4.4,31.9 4.4,31.1 6.3,29.2
LX6
  Top 0.508: 17.1,32.5 17.1,32.9 U18.6
  Top 0.61: U18.6 14.5,33 C36.2
  Top 1.27: 17.1,32.5 17,32.4 L6.1 16,31 16,32.3
N$1
  Top 0.508: R1.2 7.92,52.84 LED1.A
N$2
  Top 0.508: R2.2 9.54,58.92 LED2.A
N$3
  Top 1.27: F1.2 90.05,28.5 U$5.VBUS
N$4
  Top 0.813: 62.9,7.6 62.9,10.8
  Top 1.27: U$2.P$10 64.37,6.13 62.9,7.6 | 62.9,10.8 64,11.9 F4.2
N$5
  Top 0.254: U1.6 87.7,25.7 88,25.4 90.2,25.4 90.8,26 U$5.D-
N$6
  Top 1.27: U$2.P$12 68.3,12.3 F5.2
N$7
  Top 0.813: 80.9,10.7 80.9,7.9
  Top 1.27: F2.2 80.9,11.5 80.9,10.7 | 80.9,7.9 82.67,6.13 U$1.P$10
N$8
  Top 1.27: U$1.P$12 86.3,13.3 F3.2
N$9
  Top 0.254: U2.6 88.74,11.44 U$1.P$7
N$10
  Top 0.254: U$1.P$8 90.85,10.75 U2.1
N$11
  Top 0.254: U$2.P$7 70.74,11.46 U4.6
N$12
  Top 0.254: U$2.P$8 72.85,11.85 U4.1
N$13  (via drill 0.35)
  Top 0.254: U$2.P$5 69.5,7.37 69.5,10.5 v69.8,10.8 | v70.2,15 U5.6
  Bottom 0.254: v69.8,10.8 69.8,14.6 v70.2,15
N$14  (via drill 0.35)
  Top 0.254: U$2.P$6 74.1,7.36 74.1,11.2 v74.5,11.6 | v73,15 U5.1
  Bottom 0.254: v74.5,11.6 74.5,13.5 v73,15
N$15
  Top 0.813: 44.9,7.9 44.9,11.5
  Top 1.27: U$3.P$10 46.67,6.13 44.9,7.9 | 44.9,11.5 F6.2
N$16
  Top 0.254: U1.1 87.7,24.4 88.1,24.8 90.2,24.8 91,24 U$5.D+
N$17
  Top 0.254: U$1.P$5 87.5,7.37 87.5,14 87.5,14.1 87.5,15.1 88.2,15.8 U3.6
N$18  (via drill 0.35)
  Top 0.254: U$1.P$6 92.2,7.46 v92.2,10.2 | v93.2,14.9 92.3,15.8 U3.1
  Bottom 0.254: v92.2,10.2 92.2,13.9 v93.2,14.9
N$19
  Top 1.27: U$3.P$12 50.3,13.3 F7.2
N$20
  Top 0.254: U$3.P$7 53.2,9.21 U6.6
N$21
  Top 0.254: U$3.P$8 54.85,10.85 U6.1
N$22
  Top 0.254: U$3.P$5 51.7,7.17 51.7,15.1 52.6,16 U7.6
N$23
  Top 0.254: U$3.P$6 56.2,7.46 56.2,10.2 57.4,11.4 57.4,14.6 U7.1
N$24
  Top 0.508: R8.1 41.42,33 L2.2 | F8.1 38.98,22.4 R6.2
  Top 1.27: F8.1 36,25.4 C6.1 C10.1 37.6,32.6 L2.2 38.58,33.58
N$25
  Top 0.508: U9.5 37.95,13.95 38.2,14.2 38.2,16.4 C3.2 37.6,18.18 R6.1
N$27
  Top 0.508: U8.4 36.2,45.78 R7.1
N$28  (via drill 0.35)
  Top 0.508: U8.1 39,41.3 v38.7,41 | v34.8,41.9 34.8,42.4 33.1,44.1 C4.1
  Bottom 0.508: v38.7,41 35.4,41 34.8,41.6 v34.8,41.9
N$29
  Top 0.254: U$4.P$8 40,11.9 U9.1
N$30
  Top 0.254: U$4.P$7 37.2,11.21 U9.6
N$31
  Top 1.27: U$4.P$12 35,11.45 35,15.2 35.5,15.7 35.5,19.1 F8.2
N$33
  Top 0.508: R12.1 30.6,34.18 C14.1 | F11.1 28.02,22.42 R10.2
  Top 1.27: F11.1 28,24.4 C16.1 C14.1 27.6,33 L1.2
N$34
  Top 0.508: U11.5 30.95,13.95 31.3,14.3 31.3,16.3 C11.2 30.6,19.18 R10.1
N$36
  Top 0.508: U10.4 24.2,45.78 R11.1
N$37  (via drill 0.35)
  Top 0.508: U10.1 v27,41 | v22.1,41.4 22.08,41.42 C12.1
  Bottom 0.508: v27,41 22.5,41 v22.1,41.4
N$38  (via drill 0.35)
  Top 0.254: v32,10.6 32,11.2 U11.6
  Bottom 0.254: U$4.P$5 33.5,7.37 33.5,9.1 v32,10.6
N$39  (via drill 0.35)
  Top 0.254: U11.1 33,12.3 v33.5,11.8
  Bottom 0.254: v33.5,11.8 35.8,9.5 35.8,7.2 U$4.P$6
N$54
  Top 0.508: C34.1 5,17.6 R22.2 | L5.2 11,27 R24.1
  Top 1.27: F12.1 C34.1 C32.1 4.6,22.5 6.1,24 L5.2
N$55
  Top 0.508: U17.5 9.45,13.95 C29.2 5.18,12.58 R22.1
N$57
  Top 0.61: U16.4 5.2,36.78 R23.1
N$58  (via drill 0.35)
  Top 0.508: U16.1 v8,32 | v3,31.5 2.37,30.87 C30.1
  Bottom 0.508: v8,32 3.5,32 v3,31.5
N$59  (via drill 0.35)
  Top 0.254: v12.6,11.4 11.2,12.8 U17.6
  Bottom 0.254: U$6.P$5 15.5,7.37 15.5,9.3 13.4,11.4 v12.6,11.4
N$60  (via drill 0.35)
  Top 0.254: v14.5,12 14,12.5 U17.1
  Bottom 0.254: U$6.P$6 17.8,7.2 17.8,9.4 15.2,12 v14.5,12
N$61
  Top 0.508: R26.2 13.38,21.8 16.6,21.8 F13.1 | R28.1 17.58,24.58 L6.2
  Top 1.27: C40.1 C38.1 F13.1 18,23 L6.2
N$62
  Top 0.254: 19.3,15.6 19.3,14.5 18.75,13.95 U19.5
  Top 0.508: R26.1 12.02,17.6 C35.2 16.4,19 19.1,19 19.6,18.5 19.6,16.6 19.3,16.3 19.3,15.6
N$64
  Top 0.508: U18.4 17.2,38.78 R27.1
N$65  (via drill 0.35)
  Top 0.508: U18.1 v20,32 | v12.8,37.1 14.1,35.8 C36.1
  Bottom 0.508: v20,32 17.9,32 v12.8,37.1
N$66
  Top 0.254: U$6.P$8 18.85,10.85 U19.1
N$67
  Top 0.254: U$6.P$7 16.74,11.54 U19.6
N$68
  Top 1.27: U$6.P$12 15.8,10.24 15.8,15.4 F13.2
PS_ON  (via drill 0.35)
  Top 0.254: SW1.2 38,66.13 v38,67.9 | v38,70.9 76.65,70.9 X1.16
  Bottom 0.254: v38,67.9 v38,70.9
PWR_OK
  Top 0.254: R2.1 24.63,69.8 60.4,69.8 61.7,68.5 X1.8
VBUS1
  Top 0.813: 26.8,8 26.8,10.4
  Top 1.27: U$4.P$10 28.67,6.13 26.8,8 | 26.8,10.4 28.1,11.7 28,11.8 F11.2
VBUS3
  Top 1.27: U$6.P$10 10.47,6.13 6.8,9.8 3.5,9.8 2,11.3 F12.2

### Text on the board
tPlace: the CHARGINATOR / martin@embedblog.eu / rev 1.0 10/19 | ON | ON | -5V | GND | -12V | +5V | +12V | STBY | GND | +3.3V | +5V | +12V
tNames: U1 | U5 | U7 | U3 | U6 | U4 | U2